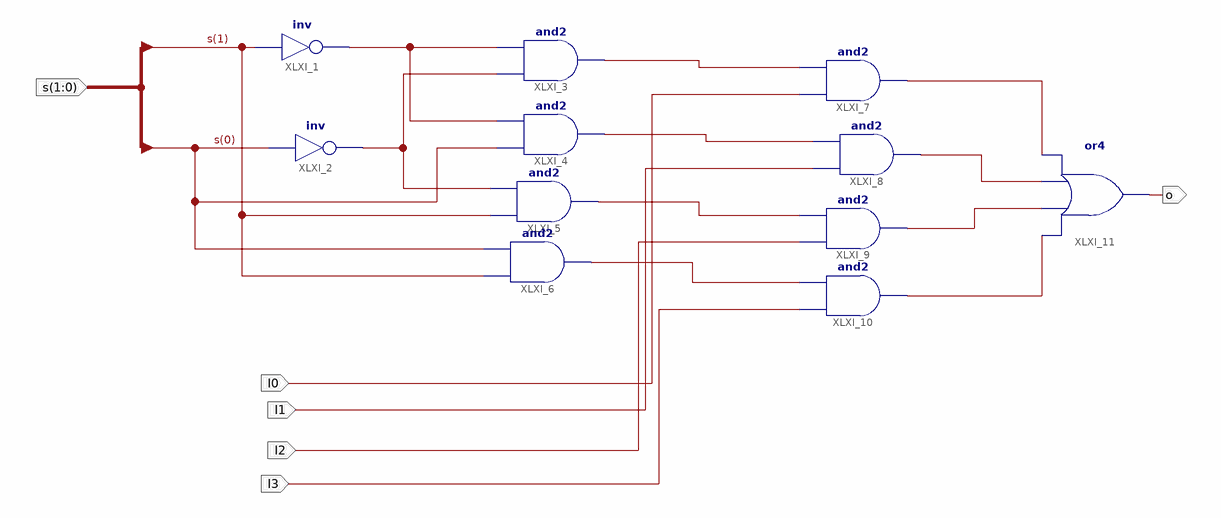
[diagram p0: schematic sheet 1]
// Xilinx ISE schematic Mux4to1.sch (kintex7) as structural Verilog: 11 symbols, 6 ports
module Mux4to1 (
  input  [1:0] s,
  input  I2,
  input  I3,
  input  I1,
  input  I0,
  output o
);

  wire XLXN_5, XLXN_6, XLXN_14, XLXN_15, XLXN_16, XLXN_17, XLXN_23, XLXN_24, XLXN_25, XLXN_26;

  not XLXI_1 (XLXN_5, s[1]);
  not XLXI_2 (XLXN_6, s[0]);
  and XLXI_3 (XLXN_14, XLXN_6, XLXN_5);
  and XLXI_4 (XLXN_15, s[0], XLXN_5);
  and XLXI_5 (XLXN_16, s[1], XLXN_6);
  and XLXI_6 (XLXN_17, s[1], s[0]);
  and XLXI_7 (XLXN_23, I0, XLXN_14);
  and XLXI_8 (XLXN_24, I1, XLXN_15);
  and XLXI_9 (XLXN_25, I2, XLXN_16);
  and XLXI_10 (XLXN_26, I3, XLXN_17);
  or XLXI_11 (o, XLXN_26, XLXN_25, XLXN_24, XLXN_23);
endmodule
